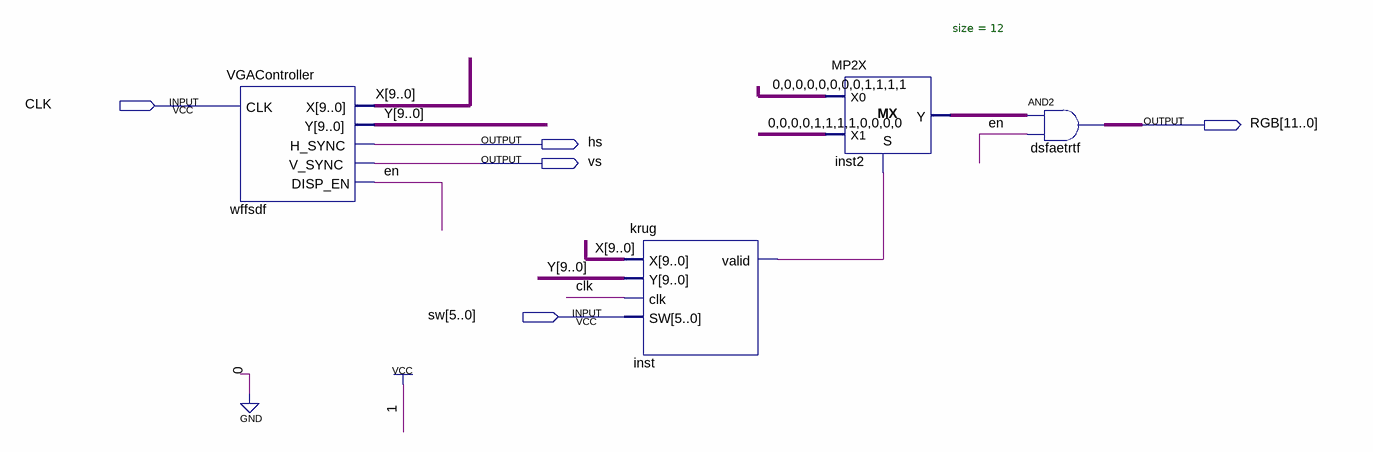
[diagram p0: schematic sheet]
// Quartus schematic ad.bdf as structural Verilog: 4 symbols, 5 pins
module ad (
  input  CLK,
  input  [5:0] sw,
  output [11:0] RGB,
  output hs,
  output vs
);

  wire en, inst_valid;
  wire [9:0] X, Y;
  wire [11:0] inst2_y;

  VGAController wffsdf (.CLK(CLK), .X(X), .Y(Y), .H_SYNC(hs), .V_SYNC(vs), .DISP_EN(en));
  krug inst (.X(X), .Y(Y), .clk(CLK), .SW(sw), .valid(inst_valid));
  MP2X #(.size(12)) inst2 (.S(inst_valid), .X0(12'b000000001111), .X1(12'b000011110000), .Y(inst2_y));
  assign RGB = inst2_y & {12{en}};  // AND2 dsfaetrtf, 12 bits wide
endmodule
